# Altium schematic sheet VL53L0X.SchDoc
size A; Author: Ehsan Shaghaei; Engineer: Ehsan Shaghaei; Organization: Innopolis University; SheetNumber: 4; SheetTotal: 4
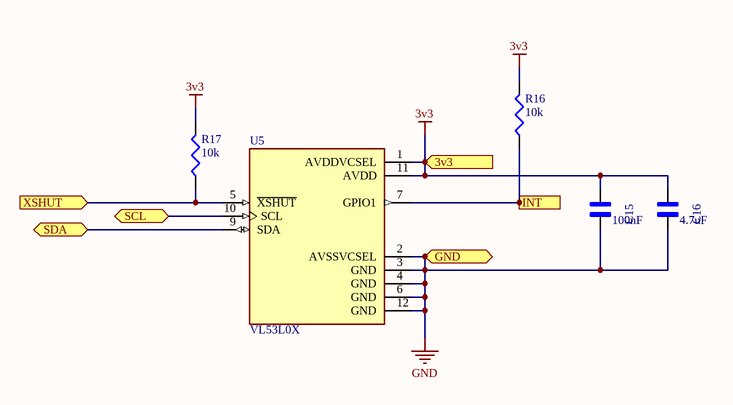
[diagram p0: VL53L0X.SchDoc]

## Parts
C15  value 100nF  [*CAPC1608X90]  (hidden comment: GX035C104MAT2-500)
C16  value 4.7uF  [*CAPC1608X90]  (hidden comment: GX035C104MAT2-500)
R16  value 10k  [J1-0603]  (hidden comment: RC0603FR-0710KL)
R17  value 10k  [J1-0603]  (hidden comment: RC0603FR-0710KL)
U5  VL53L0X  [SENSOR_VL53L0X]

## Ports
3v3 (in), GND (bidir), INT (out), SCL (bidir), SDA (bidir), XSHUT (in)

## Nets
3v3: C15.2 C16.2 R16.2 R17.2 U5.1(AVDDVCSEL) U5.11(AVDD) ; port 3v3
GND: C15.1 C16.1 U5.2(AVSSVCSEL) U5.3(GND) U5.4(GND) U5.6(GND) U5.12(GND) ; port GND
INT: R16.1 U5.7(GPIO1) ; port INT
SCL: U5.10(SCL) ; port SCL
SDA: U5.9(SDA) ; port SDA
XSHUT: R17.1 U5.5(~{XSHUT}) ; port XSHUT

## Library data of the parts
C15 C16 = GX035C104MAT2-500: Cap Thin Film 0.1uf 50v 0603; MF: AVX; MP: GX035C104MAT2-500 or CL10B104JB8NNNC; Pacage Metric: 1608; Type: SMD; Package: 0603 AVX; SnapEDA_Link: https://www.snapeda.com/parts/GX035C104MAT2-500/AVX/view-part/?ref=snap
R16 R17 = RC0603FR-0710KL: 10 kOhms 1 0.1 W 1 10 W Chip Resistor 0603 1608 Metric Thick Film; Pacage Metric: 1608; MF: Yageo or NXP; MP: 10K 1% 0603; ChipDip_Link: https://www.chipdip.ru/product0/9000079736; HelpURL: https://www.chipdip.ru/product0/9000079736; Package: R0603; Type: SMD; SnapEDA_Link: https://www.snapeda.com/parts/RC0603FR-0710KL/Yageo/view-part/?ref=dk&t=RC0603FR-0710KL&con_ref=None
U5 = VL53L0X: VL53L0X - Light, 3D Time-of-Flight _ToF_ Sensor Evaluation Board; MF: STMicroelectronics; designer: Ehsan Shaghaei; MP: VL53L0X; Package: None; Price: None; Availability: Unavailable; SnapEDA_Link: https://www.snapeda.com/parts/VL53L0X/STMicroelectronics/view-part/473967/?ref=snap; Value: *; chipdip_link: https://www.chipdip.ru/product/vl53l0cxv0dh-1-stm; datasheet: http://www.farnell.com/datasheets/2291222.pdf